# EAGLE design rt_solder_simple_V1.2 (EAGLE 9.6.0)
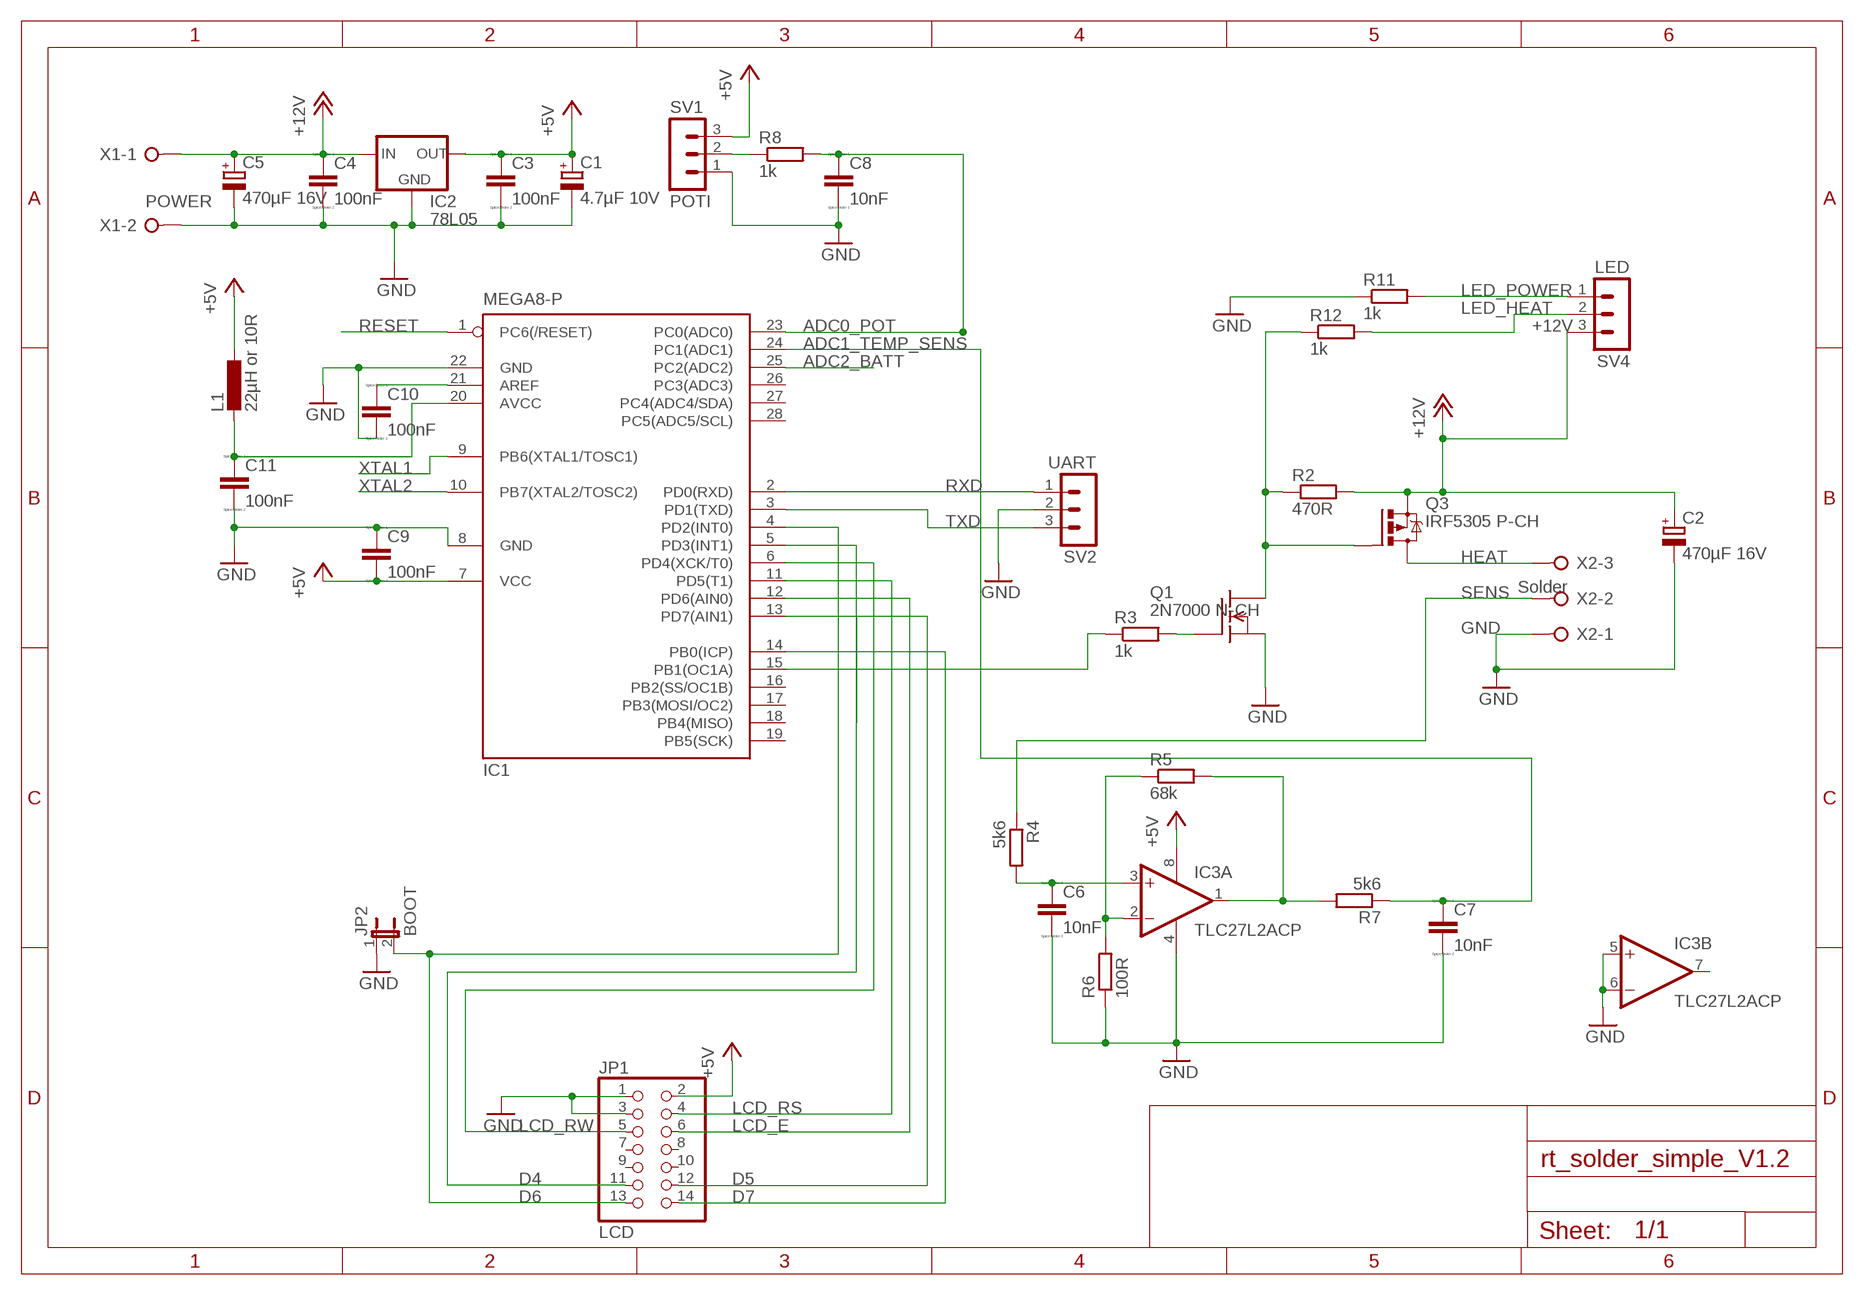
[diagram p0: schematic, sheet 1]

## Parts
C1  4.7µF 10V  CPOL-EUE2.5-6  [E2,5-6]
C2  470µF 16V  CPOL-EUE3.5-10  [E3,5-10]
C3  100nF  C-EU050-035X075  [C050-035X075]
C4  100nF  C-EU050-035X075  [C050-035X075]
C5  470µF 16V  CPOL-EUE3.5-10  [E3,5-10]
C6  10nF  C-EU050-035X075  [C050-035X075]
C7  10nF  C-EU050-035X075  [C050-035X075]
C8  10nF  C-EU050-035X075  [C050-035X075]
C9  100nF  C-EU050-035X075  [C050-035X075]
C10  100nF  C-EU050-035X075  [C050-035X075]
C11  100nF  C-EU050-035X075  [C050-035X075]
IC1  MEGA8-P  [DIL28-3]
IC2  78L05  78XXS  [78XXS]
IC3  TLC27L2ACP  [DIL08]
JP1  LCD  PINHD-2X7  [2X07]
JP2  BOOT  JP1E  [JP1]
L1  22µH or 10R  L-EU0207/10  [0207/10]
Q1  2N7000 N-CH  VN2222KM  [TO237]
Q3  IRF5305 P-CH  IRF9530  [TO220BV]
R2  470R  R-EU_0207/10  [0207/10]
R3  1k  R-EU_0207/10  [0207/10]
R4  5k6  R-EU_0207/10  [0207/10]
R5  68k  R-EU_0207/10  [0207/10]
R6  100R  R-EU_0207/10  [0207/10]
R7  5k6  R-EU_0207/10  [0207/10]
R8  1k  R-EU_0207/10  [0207/10]
R11  1k  R-EU_0207/10  [0207/10]
R12  1k  R-EU_0207/10  [0207/10]
SV1  POTI  MA03-1  [MA03-1]
SV2  UART  MA03-1  [MA03-1]
SV4  LED  MA03-1  [MA03-1]
X1  POWER  W237-02P  [W237-132]
X2  Solder  W237-3E  [W237-3E]

## Nets
+5V: C1.+ C3.1 C9.2 IC1.7(VCC) IC2.OUT IC3.8(C:VDD) JP1.2 L1.1 SV1.3
+12V: C2.+ C4.1 C5.+ IC2.IN Q3.S R2.2 SV4.3 X1.1
ADC0_POT: C8.1 IC1.23(PC0(ADC0)) R8.2
ADC1_TEMP_SENS: C7.1 IC1.24(PC1(ADC1)) R7.1
ADC2_BATT: IC1.25(PC2(ADC2))
D4: IC1.5(PD3(INT1)) JP1.11
D5: IC1.13(PD7(AIN1)) JP1.12
D6: IC1.4(PD2(INT0)) JP1.13 JP2.2
D7: IC1.14(PB0(ICP)) JP1.14
GND: C1.- C2.- C3.2 C4.2 C5.- C6.2 C7.2 C8.2 C9.1 C10.2 C11.2 IC1.8(GND) IC1.22(GND) IC2.GND IC3.4(C:GND) IC3.5(B:+IN) IC3.6(B:-IN) JP1.1 JP1.3 JP2.1 Q1.3(S) R6.1 R11.1 SV1.1 SV2.2 X1.2 X2.1
HEAT: Q3.D X2.3
LCD_E: IC1.12(PD6(AIN0)) JP1.6
LCD_RS: IC1.11(PD5(T1)) JP1.4
LCD_RW: IC1.6(PD4(XCK/T0)) JP1.5
LED_HEAT: R12.2 SV4.2
LED_POWER: R11.2 SV4.1
N$3: Q1.1(D) Q3.G R2.1 R12.1
N$4: Q1.2(G) R3.2
N$5: C6.1 IC3.3(A:+IN) R4.2
N$6: IC3.2(A:-IN) R5.1 R6.2
N$8: IC3.1(A:OUT) R5.2 R7.2
N$10: IC1.15(PB1(OC1A)) R3.1
N$12: R8.1 SV1.2
N$16: C11.1 IC1.20(AVCC) L1.2
N$17: C10.1 IC1.21(AREF)
RESET: IC1.1(PC6(/RESET))
RXD: IC1.2(PD0(RXD)) SV2.1
SENS: R4.1 X2.2
TXD: IC1.3(PD1(TXD)) SV2.3
XTAL1: IC1.9(PB6(XTAL1/TOSC1))
XTAL2: IC1.10(PB7(XTAL2/TOSC2))
Unconnected: IC1.16(PB2(SS/OC1B)) IC1.17(PB3(MOSI/OC2)) IC1.18(PB4(MISO)) IC1.19(PB5(SCK)) IC1.26(PC3(ADC3)) IC1.27(PC4(ADC4/SDA)) IC1.28(PC5(ADC5/SCL)) IC3.7(B:OUT) JP1.7 JP1.8 JP1.9 JP1.10

## Library data of the parts
C1 C2 C5 = rcl:CPOL-EU: POLARIZED CAPACITOR, European symbol
C3 C4 C6-C11 = rcl:C-EU: CAPACITOR, European symbol
IC1 = atmel:MEGA8-P: MICROCONTROLLER 8 Kbytes FLASH, 1 kbytes SRAM, 512 bytes EEPROM, USART, 4-channel 10 bit ADC, 2-channel 8 bit ADC Pin compatible with Atmega48, ATMega88, ATMega168 Source: avr.lbr; OC_FARNELL: unknown; OC_NEWARK: unknown
IC2 = v-reg:78XXS: VOLTAGE REGULATOR
IC3 = linear:TLC27L*: LinCMOS(TM) PRECISION DUAL OPERATIONAL AMPLIFIERS Source: http://focus.ti.com/lit/ds/symlink/tlc27l2.pdf
JP1 = pinhead:PINHD-2X7: PIN HEADER
JP2 = jumper:JP1E: JUMPER
L1 = rcl:L-EU: INDUCTOR, European symbol
Q1 = transistor-fet:VN2222KM: N-Channel Enhancement MOSFET (VMOS); 60V; 0,5A; 7,5Ohm
Q3 = transistor-power:IRF9530: P-CHANNEL HEXFET POWER-MOS-FET Source: http://www.irf.com/product-info/datasheets/data/irf9530.pdf
R2-R8 R11 R12 = rcl:R-EU_: RESISTOR, European symbol
SV1 SV2 SV4 = con-lstb:MA03-1: PIN HEADER; OC_FARNELL: unknown; OC_NEWARK: unknown
X1 = con-wago-508:W237-02P: WAGO SREW CLAMP; OC_FARNELL: unknown; OC_NEWARK: unknown
X2 = con-wago-508:W237-3E: WAGO SREW CLAMP; OC_FARNELL: unknown; OC_NEWARK: unknown

## Board
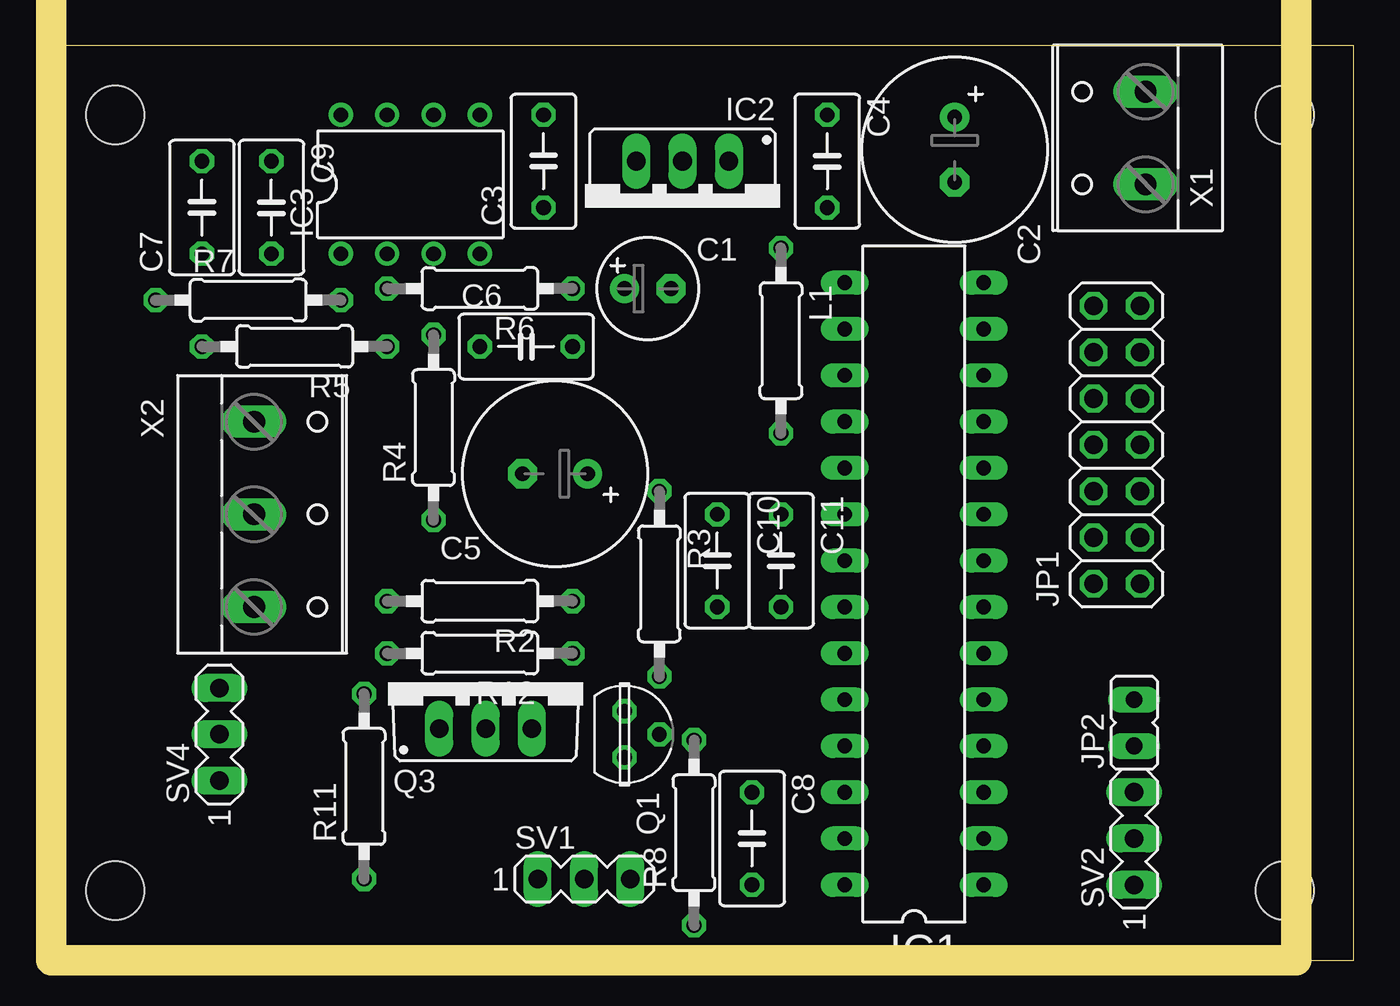
[diagram p1: board, top side]
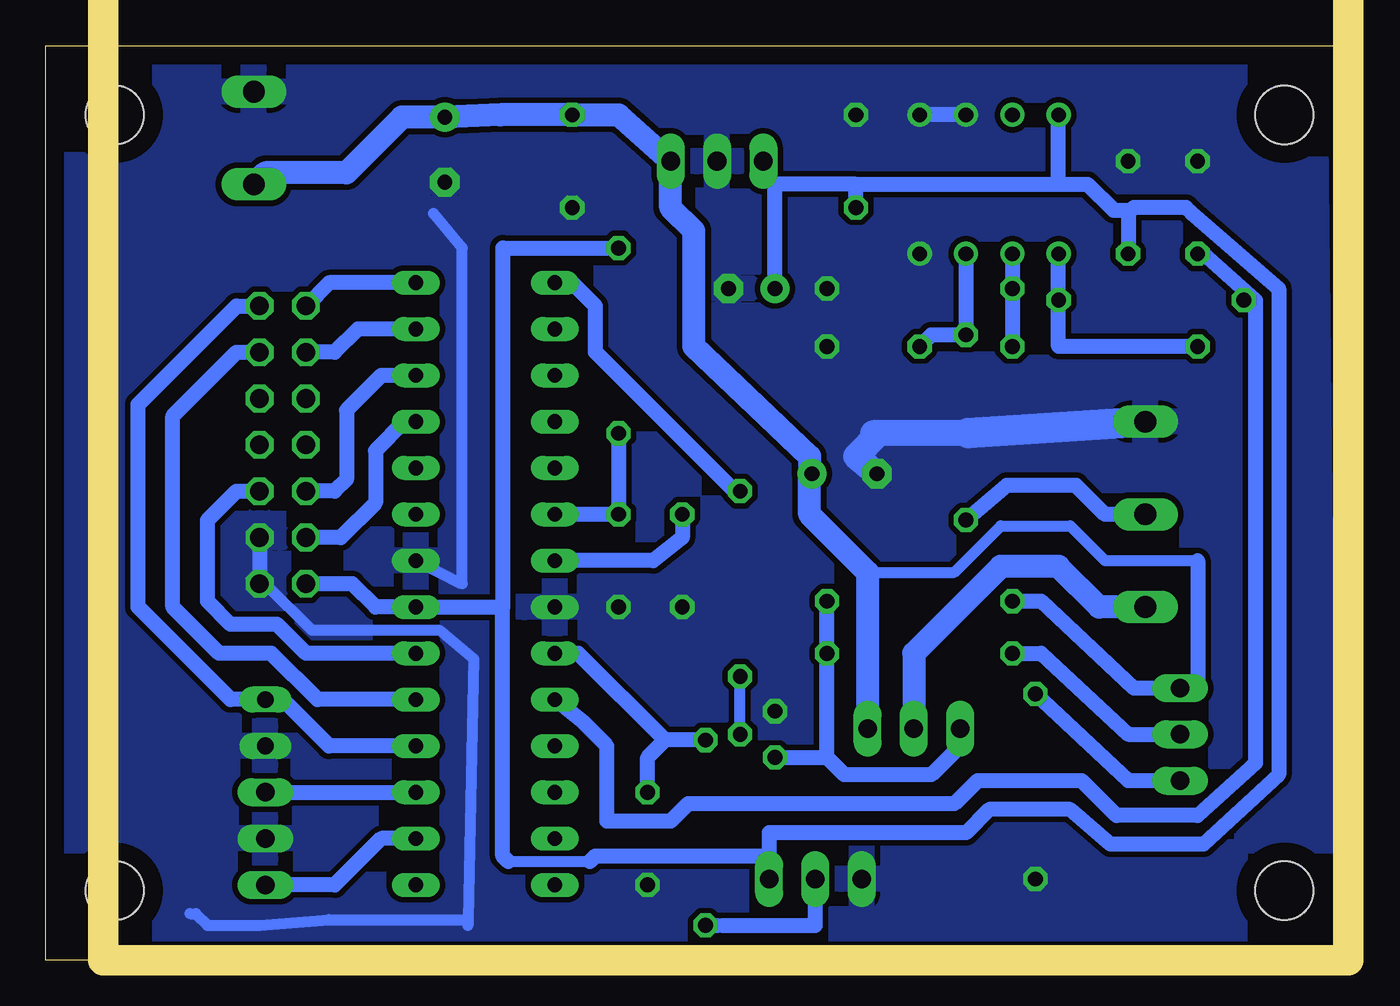
[diagram p2: board, bottom side, seen from below]

Size 71.74 x 50.16 mm. Coordinates in mm from the lower left corner, seen from the top.
Outline: 0,0 71.74,0 71.74,50.16 0,50.16 0,0
Copper layers (1*16): Top 0.035mm / dielectric 1.5mm / Bottom 0.035mm
Design rules "default *": minimum track width 8mil, minimum drill 24mil, track to track 12mil, track to pad 12mil, pad to pad 12mil, via to via 12mil, smd to smd 8mil, copper to edge 40mil, drill to drill 8mil, minimum pad ring 10mil, minimum via ring 8mil, stop-mask expansion 4mil, vias tented up to drill 0mil, thermal gap 10mil
Holes 3.2 mm at 3.81,46.35 3.81,3.81 67.94,3.81 67.94,46.35
Milling: 4 lines

### Footprints (pad centres in the part's own frame; a part is rotated, then mirrored left to right if it is on the bottom)
E2,5-6 = drill 0.813 pad 1.6: + -1.27,0 | drill 0.813 pad 1.6 octagon: - 1.27,0
E3,5-10 = drill 0.813 pad 1.6: + -1.778,0 | drill 0.813 pad 1.6 octagon: - 1.778,0
C050-035X075 = drill 0.813 octagon: 1 -2.54,0; 2 2.54,0
DIL28-3 = drill 0.813 long: 1 -16.51,-3.81; 2 -13.97,-3.81; 3 -11.43,-3.81; 4 -8.89,-3.81; 5 -6.35,-3.81; 6 -3.81,-3.81; 7 -1.27,-3.81; 8 1.27,-3.81; 9 3.81,-3.81; 10 6.35,-3.81; 11 8.89,-3.81; 12 11.43,-3.81; 13 13.97,-3.81; 14 16.51,-3.81; 15 16.51,3.81; 16 13.97,3.81; 17 11.43,3.81; 18 8.89,3.81; 19 6.35,3.81; 20 3.81,3.81; 21 1.27,3.81; 22 -1.27,3.81; 23 -3.81,3.81; 24 -6.35,3.81; 25 -8.89,3.81; 26 -11.43,3.81; 27 -13.97,3.81; 28 -16.51,3.81
78XXS = drill 1.016 long: GND 0,-2.54; IN -2.54,-2.54; OUT 2.54,-2.54
DIL08 = drill 0.813 pad 1.27: 1 -3.81,-3.81; 2 -1.27,-3.81; 3 1.27,-3.81; 4 3.81,-3.81; 5 3.81,3.81; 6 1.27,3.81; 7 -1.27,3.81; 8 -3.81,3.81
2X07 = drill 1.016 octagon: 1 -7.62,-1.27; 2 -7.62,1.27; 3 -5.08,-1.27; 4 -5.08,1.27; 5 -2.54,-1.27; 6 -2.54,1.27; 7 0,-1.27; 8 0,1.27; 9 2.54,-1.27; 10 2.54,1.27; 11 5.08,-1.27; 12 5.08,1.27; 13 7.62,-1.27; 14 7.62,1.27
JP1 = drill 0.914 long: 1 0,-1.27; 2 0,1.27
0207/10 = drill 0.813 octagon: 1 -5.08,0; 2 5.08,0
TO237 = drill 0.813 octagon: 1 1.27,0; 2 0,1.905; 3 -1.27,0
TO220BV = drill 1.016 long: D 0,-2.54; G -2.54,-2.54; S 2.54,-2.54
MA03-1 = drill 1.016 long: 1 -2.54,0; 2 0,0; 3 2.54,0
W237-132 = drill 1.194 long: 1 -2.54,-0.635; 2 2.54,-0.635
W237-3E = drill 1.194 long: 1 -5.08,-0.635; 2 0,-0.635; 3 5.08,-0.635

### Placement (x,y rotation side)
C1  33.02,36.83 0 top
C2  49.85,44.45 270 top
C3  27.3,43.81 90 top
C4  42.86,43.81 270 top
C5  27.94,26.67 180 top
C6  26.35,33.66 0 top
C7  8.57,41.27 90 top
C8  38.73,6.67 270 top
C9  12.38,41.27 270 top
C10  36.83,21.91 270 top
C11  40.32,21.91 270 top
IC1  47.62,20.64 90 top
IC2  34.93,41.27 180 top
IC3  20,42.55 0 top
JP1  58.74,28.26 90 top
JP2  59.69,13.02 0 top
L1  40.32,33.97 270 top
Q1  31.75,12.38 270 top
Q3  24.13,15.24 0 top
R2  23.81,19.68 180 top
R3  33.66,20.64 270 top
R4  21.27,29.21 90 top
R5  13.65,33.66 180 top
R6  23.81,36.83 180 top
R7  11.11,36.2 0 top
R8  35.56,6.99 90 top
R11  17.46,9.53 90 top
R12  23.81,16.83 180 top
SV1  29.53,4.45 0 top
SV2  59.69,6.67 90 top
SV4  9.53,12.38 90 top
X1  59.69,45.09 90 top
X2  12.07,24.45 270 top

### Tracks (layer width: path | path; a pad name or v marks a point on that pad's centre or on a via)
+5V
  Bottom 0.61: 41.91,5.4 46.36,5.4
  Bottom 0.813: 16.19,42.55 IC3.8 | C3.1 27.31,42.55 | 27.31,42.55 31.75,42.55 | 31.75,42.55 32.39,42.86 IC2.OUT | 27.31,42.55 16.19,42.55 | 46.67,19.37 IC1.7 53.66,19.37 54.93,20.64 JP1.2 | 46.67,19.37 46.67,39.05 L1.1 | C1.+ 31.75,42.55 | 32.07,5.71 41.59,5.71 41.91,5.4 | 16.19,42.55 14.6,42.55 13.18,41.12 12.22,41.12 | 12.22,41.12 12.38,40.96 C9.2 | 12.22,41.12 12.07,41.27 9.21,41.27 8.89,40.96 4.13,36.83 4.13,10.16 8.26,6.35 13.34,6.35 15.56,8.26 20,8.26 21.27,6.99 32.07,6.99 32.07,5.71 | 46.36,5.4 46.67,5.71 46.67,19.37 | 32.07,5.71 SV1.3
+12V
  Bottom 0.61: 26.67,21.27 21.91,21.27 19.37,23.81 15.56,23.81 13.65,21.91 8.57,21.91
  Bottom 0.813: 8.57,21.91 8.57,14.61 SV4.3 12.07,14.92 17.15,19.68 R2.2
  Bottom 1.27: 29.84,26.8 29.84,24.45 26.67,21.27 Q3.S | X1.1 59.69,43.18 55.25,43.18 52.2,46.23 C2.+ 46.8,46.35 C4.1 40.32,46.35 IC2.IN 37.47,41.27 36.19,40.01 36.19,33.66 29.84,27.62 29.84,26.8 | 29.84,26.8 C5.+
ADC0_POT
  Bottom 0.813: IC1.23 42.54,16.83 37.78,12.06 | R8.2 37.78,12.06 | C8.1 38.73,11.11 37.78,12.06
ADC1_TEMP_SENS
  Bottom 0.813: R7.1 5.4,36.2 | 5.4,36.2 8.26,38.73 C7.1 | 5.4,36.2 5.4,10.79 8.57,7.94 13.02,7.94 14.92,9.84 20.64,9.84 21.91,8.57 36.51,8.57 37.47,7.62 40.96,7.62 40.96,11.75 42.23,13.02 IC1.24
D4
  Bottom 0.813: JP1.11 61.28,33.34 64.77,29.84 64.77,19.37 62.23,16.83 59.37,16.83 56.83,14.29 IC1.5
D5
  Bottom 0.813: IC1.13 54.61,34.61 55.88,33.34 JP1.12
D6
  Bottom 0.813: JP1.13 61.28,35.88 66.68,30.48 66.68,19.37 61.6,14.29 JP2.2 58.74,14.29 56.2,11.75 IC1.4
D7
  Bottom 0.813: IC1.14 56.2,37.15 JP1.14
GND
  Bottom 0.61: JP1.1 59.69,20.64 57.15,18.1 50.16,18.1 48.26,16.51 48.58,2.22 | 48.58,2.22 48.58,1.91 | IC1.8 48.9,20.64 48.9,39.05 50.48,40.96 | 63.82,2.54 63.5,2.54 62.86,1.91 60.01,1.91 56.2,2.22 48.58,2.22
  Bottom 0.813: IC3.6 IC3.5 | JP1.3 JP1.1
  Bottom 1.422: 21.15,28.89 26.04,28.89 | 26.04,28.89 26.35,28.89 | C5.- 27.31,27.62 26.04,28.89
  Bottom 1.676: X2.1 21.15,28.89
  pour Bottom: 2.22,57.47 70.17,57.47 70.17,1.27 1.59,0.95
HEAT
  Bottom 1.27: X2.3 13.97,19.37 16.19,21.59 19.37,21.59 24.13,16.83 Q3.D
LCD_E
  Bottom 0.813: IC1.12 53.34,32.07 55.25,30.16 55.25,26.35 55.88,25.72 JP1.6
LCD_RS
  Bottom 0.813: IC1.11 52.07,29.53 53.66,27.94 53.66,25.08 55.56,23.18 JP1.4
LCD_RW
  Bottom 0.813: JP1.5 61.28,25.72 62.86,24.13 62.86,19.68 61.6,18.41 59.05,18.41 57.47,16.83 IC1.6
LED_HEAT
  Bottom 0.813: R12.2 17.15,16.83 12.38,12.38 SV4.2
LED_POWER
  Bottom 0.813: SV4.1 12.38,9.84 R11.2
N$3
  Bottom 0.813: 28.89,11.11 R12.1 R2.1 | Q1.1 28.89,11.11 | Q3.G 21.59,11.75 23.18,10.16 27.94,10.16 28.89,11.11
N$4
  Bottom 0.61: Q1.2 R3.2
N$5
  Bottom 0.813: C6.1 23.18,34.29 R4.2 IC3.3
N$6
  Bottom 0.813: IC3.2 R6.2 R5.1
N$8
  Bottom 0.813: IC3.1 R7.2 16.19,33.66 R5.2
N$10
  Bottom 0.813: R3.1 33.97,25.72 41.59,33.34 41.59,35.88 42.86,37.15 IC1.15
N$12
  Bottom 0.61: 34.93,1.91 34.61,1.91
  Bottom 0.813: R8.1 34.93,1.91 | 34.61,1.91 29.53,1.91 SV1.2
N$16
  Bottom 0.813: IC1.20 C11.1 L1.2
N$17
  Bottom 0.813: C10.1 36.83,23.18 38.42,21.91 IC1.21
RXD
  Bottom 0.813: IC1.2 53.34,6.67 55.88,4.13 SV2.1
SENS
  Bottom 0.813: X2.2 13.65,24.45 15.24,26.04 19.05,26.04 R4.1
TXD
  Bottom 0.813: SV2.3 IC1.3

### Text on the board
tValues: GND | 12V | GND | SENS | HEAT | 12V | LED_HEAT | LED_POWER | GND | 5V
Document: 14 | 1 | TXD | RXD